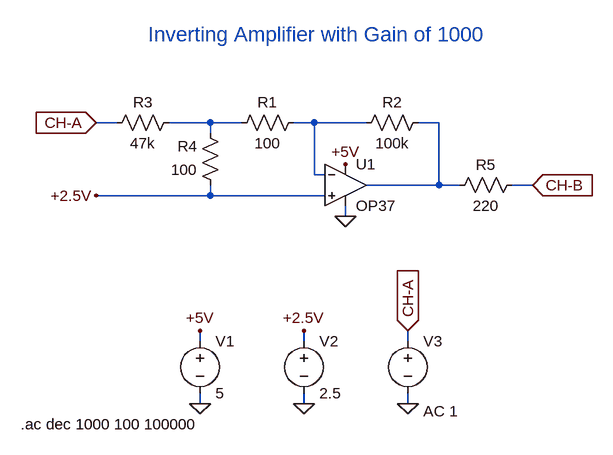
[diagram p0: schematic inv_amp_with_gain_1000_ltspice.asc]
inv_amp_with_gain_1000_ltspice.asc, the LTspice schematic file:
Version 4
SHEET 1 880 680
WIRE -128 48 -160 48
WIRE 16 48 -48 48
WIRE 64 48 16 48
WIRE 176 48 144 48
WIRE 256 48 176 48
WIRE 368 48 336 48
WIRE 16 64 16 48
WIRE 176 128 176 48
WIRE 192 128 176 128
WIRE 368 144 368 48
WIRE 368 144 256 144
WIRE 400 144 368 144
WIRE 512 144 480 144
WIRE 16 160 16 144
WIRE 16 160 -160 160
WIRE 192 160 16 160
WIRE 224 192 224 176
WIRE 0 384 0 368
WIRE 160 384 160 368
WIRE 320 384 320 368
WIRE 0 480 0 464
WIRE 160 480 160 464
WIRE 320 480 320 464
FLAG 224 192 0
FLAG 224 112 +5V
FLAG -160 160 +2.5V
FLAG -160 48 CH-A
IOPIN -160 48 In
FLAG 512 144 CH-B
IOPIN 512 144 In
FLAG 0 480 0
FLAG 160 480 0
FLAG 0 368 +5V
FLAG 160 368 +2.5V
FLAG 320 480 0
FLAG 320 368 CH-A
IOPIN 320 368 In
SYMBOL Opamps\\OP37 224 80 R0
SYMATTR InstName U1
SYMBOL res 160 32 R90
WINDOW 0 0 56 VBottom 2
WINDOW 3 32 56 VTop 2
SYMATTR InstName R1
SYMATTR Value 100
SYMBOL res 352 32 R90
WINDOW 0 0 56 VBottom 2
WINDOW 3 32 56 VTop 2
SYMATTR InstName R2
SYMATTR Value 100k
SYMBOL res -32 32 R90
WINDOW 0 0 56 VBottom 2
WINDOW 3 32 56 VTop 2
SYMATTR InstName R3
SYMATTR Value 47k
SYMBOL res 32 160 R180
WINDOW 0 36 76 Left 2
WINDOW 3 36 40 Left 2
SYMATTR InstName R4
SYMATTR Value 100
SYMBOL res 384 160 R270
WINDOW 0 32 56 VTop 2
WINDOW 3 0 56 VBottom 2
SYMATTR InstName R5
SYMATTR Value 220
SYMBOL voltage 0 368 R0
SYMATTR InstName V1
SYMATTR Value 5
SYMBOL voltage 160 368 R0
SYMATTR InstName V2
SYMATTR Value 2.5
SYMBOL voltage 320 368 R0
WINDOW 123 24 124 Left 2
WINDOW 39 0 0 Left 0
SYMATTR Value2 AC 1
SYMATTR InstName V3
SYMATTR Value ""
TEXT -80 -88 Left 3 ;Inverting Amplifier with Gain of 1000
TEXT -276 512 Left 2 !.ac dec 1000 100 100000

The netlist it stands for:
* inv_amp_with_gain_1000_ltspice.asc
XU1 +2.5V N002 +5V 0 N003 LT1037  ; OP37, pins In+ In- V+ V- OUT
R1 N002 N001 100
R2 N003 N002 100k
R3 N001 CH-A 47k
R4 +2.5V N001 100
R5 N003 CH-B 220
V1 +5V 0 5
V2 +2.5V 0 2.5
V3 CH-A 0 AC 1
* Inverting Amplifier with Gain of 1000
.ac dec 1000 100 100000
.lib LTC.lib
.backanno
.end